# EAGLE design v1.1.0 (EAGLE 9.2.0)

## Sheet 1 of 2
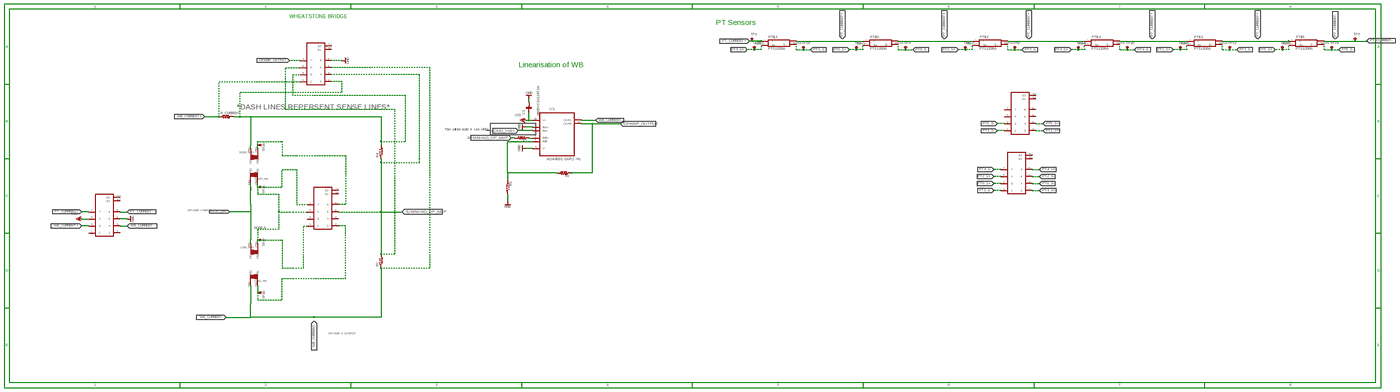
[diagram p0: schematic, sheet 1, overview]
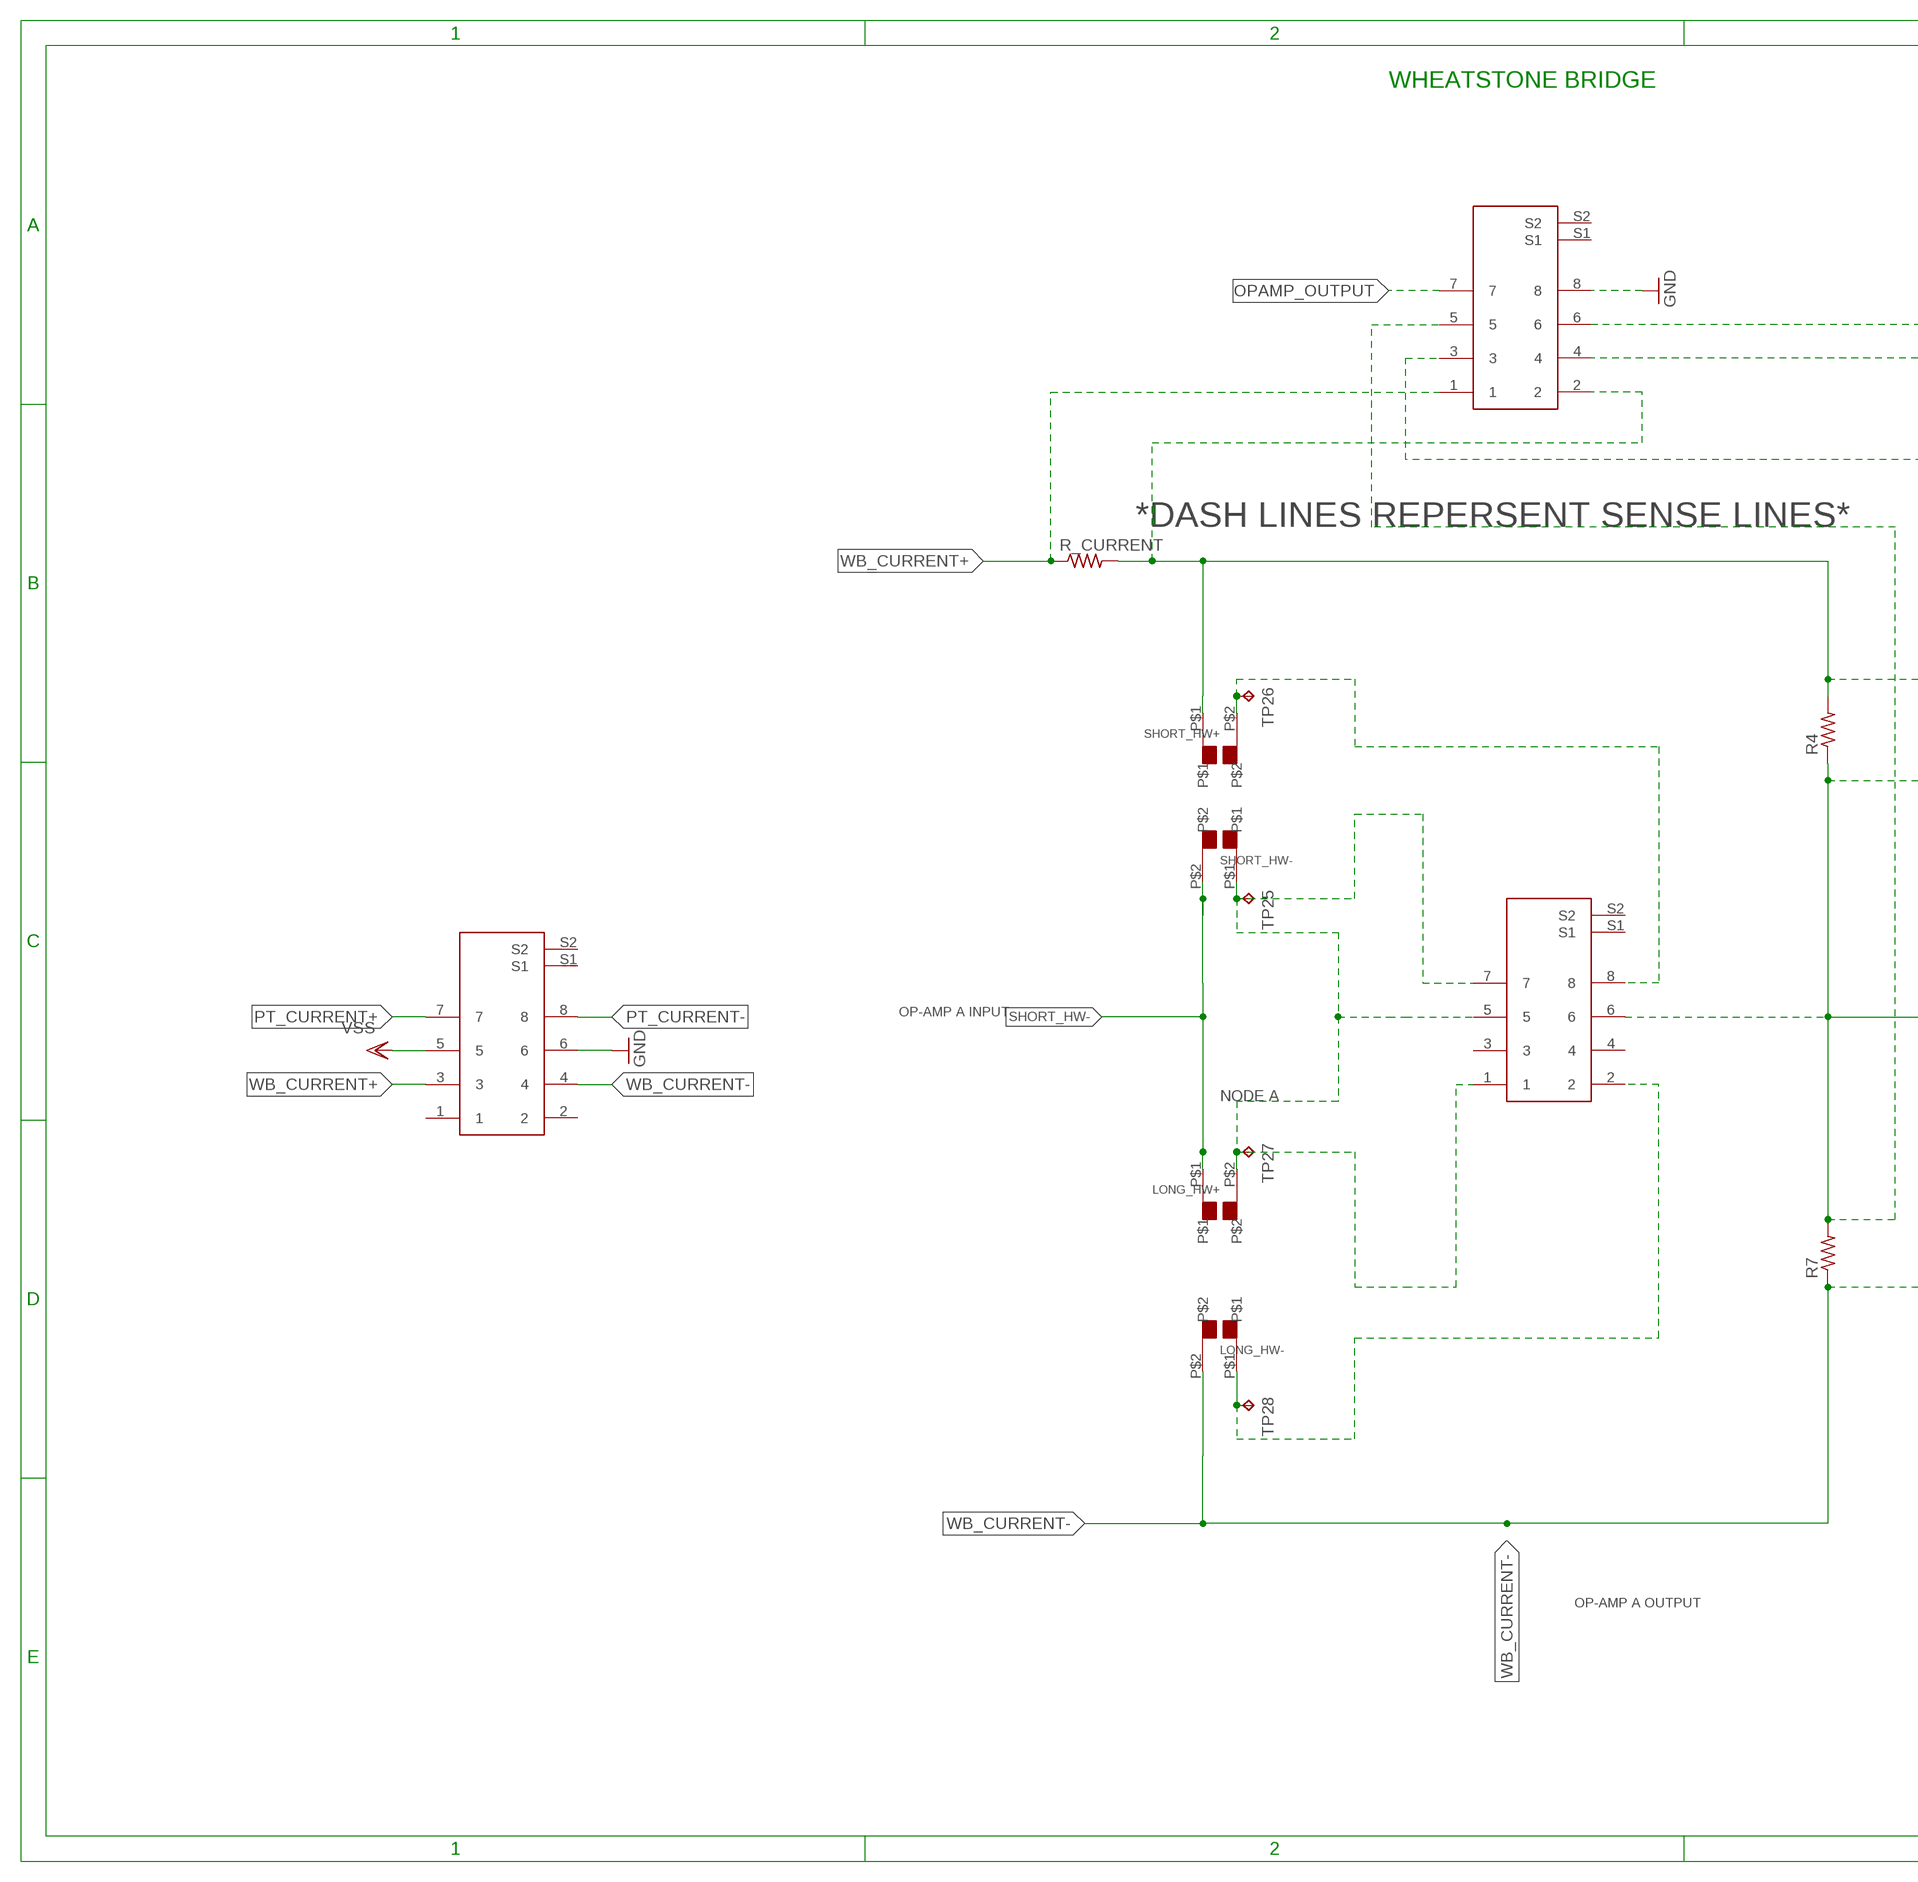
[diagram p1: schematic, sheet 1, part 1 of 4]
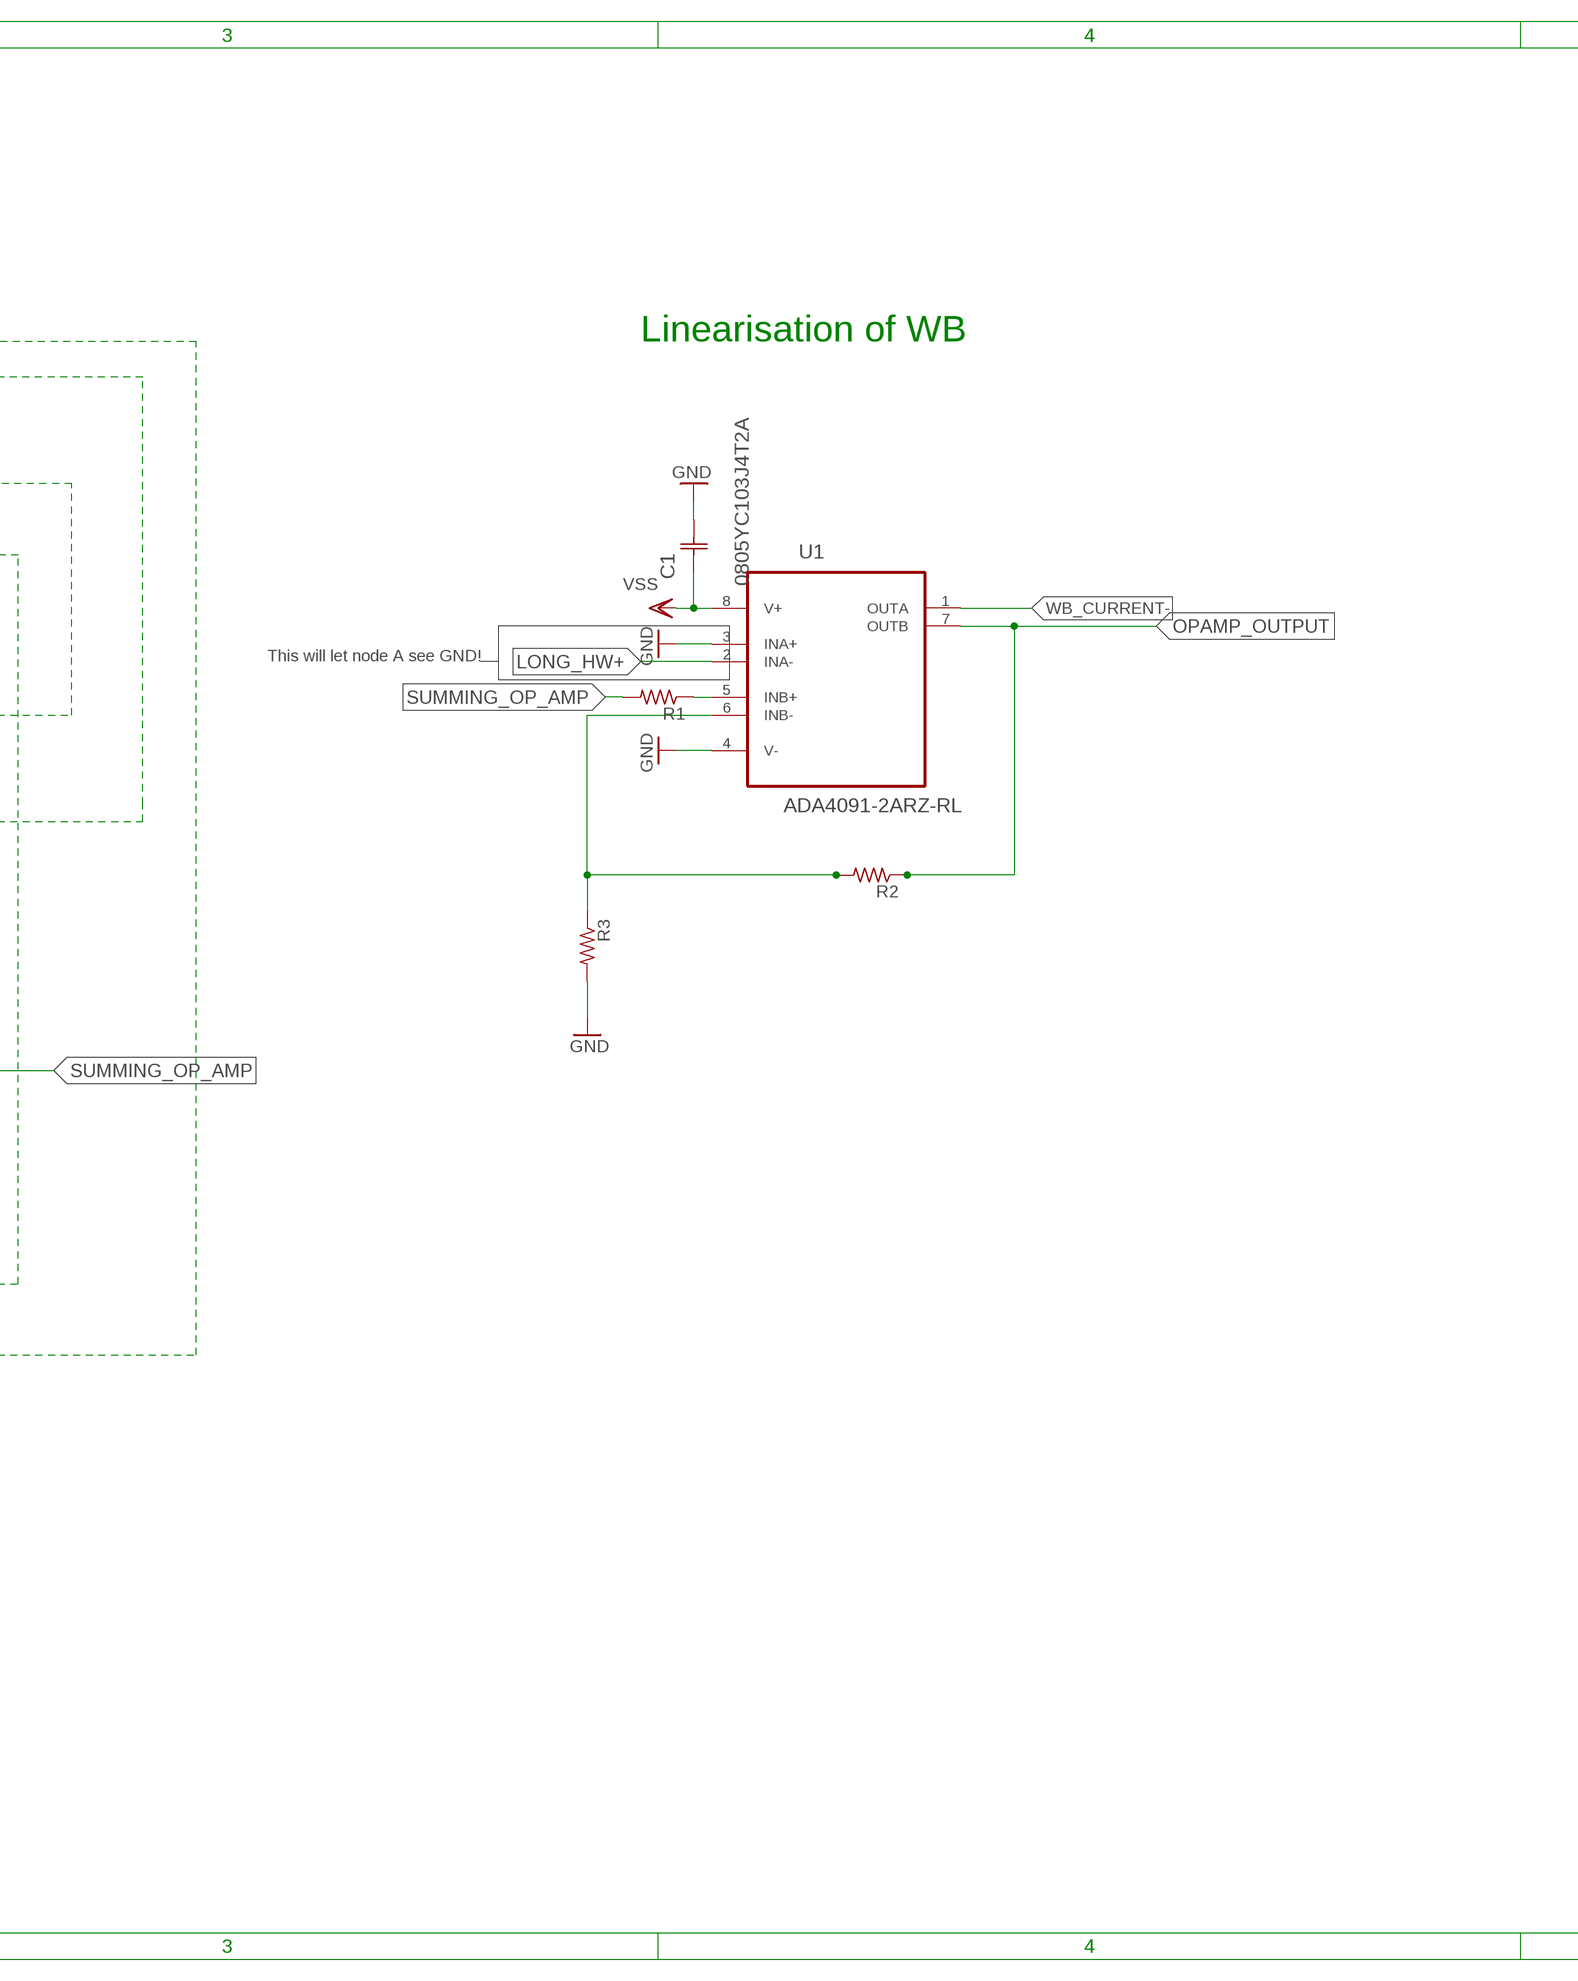
[diagram p2: schematic, sheet 1, part 2 of 4]
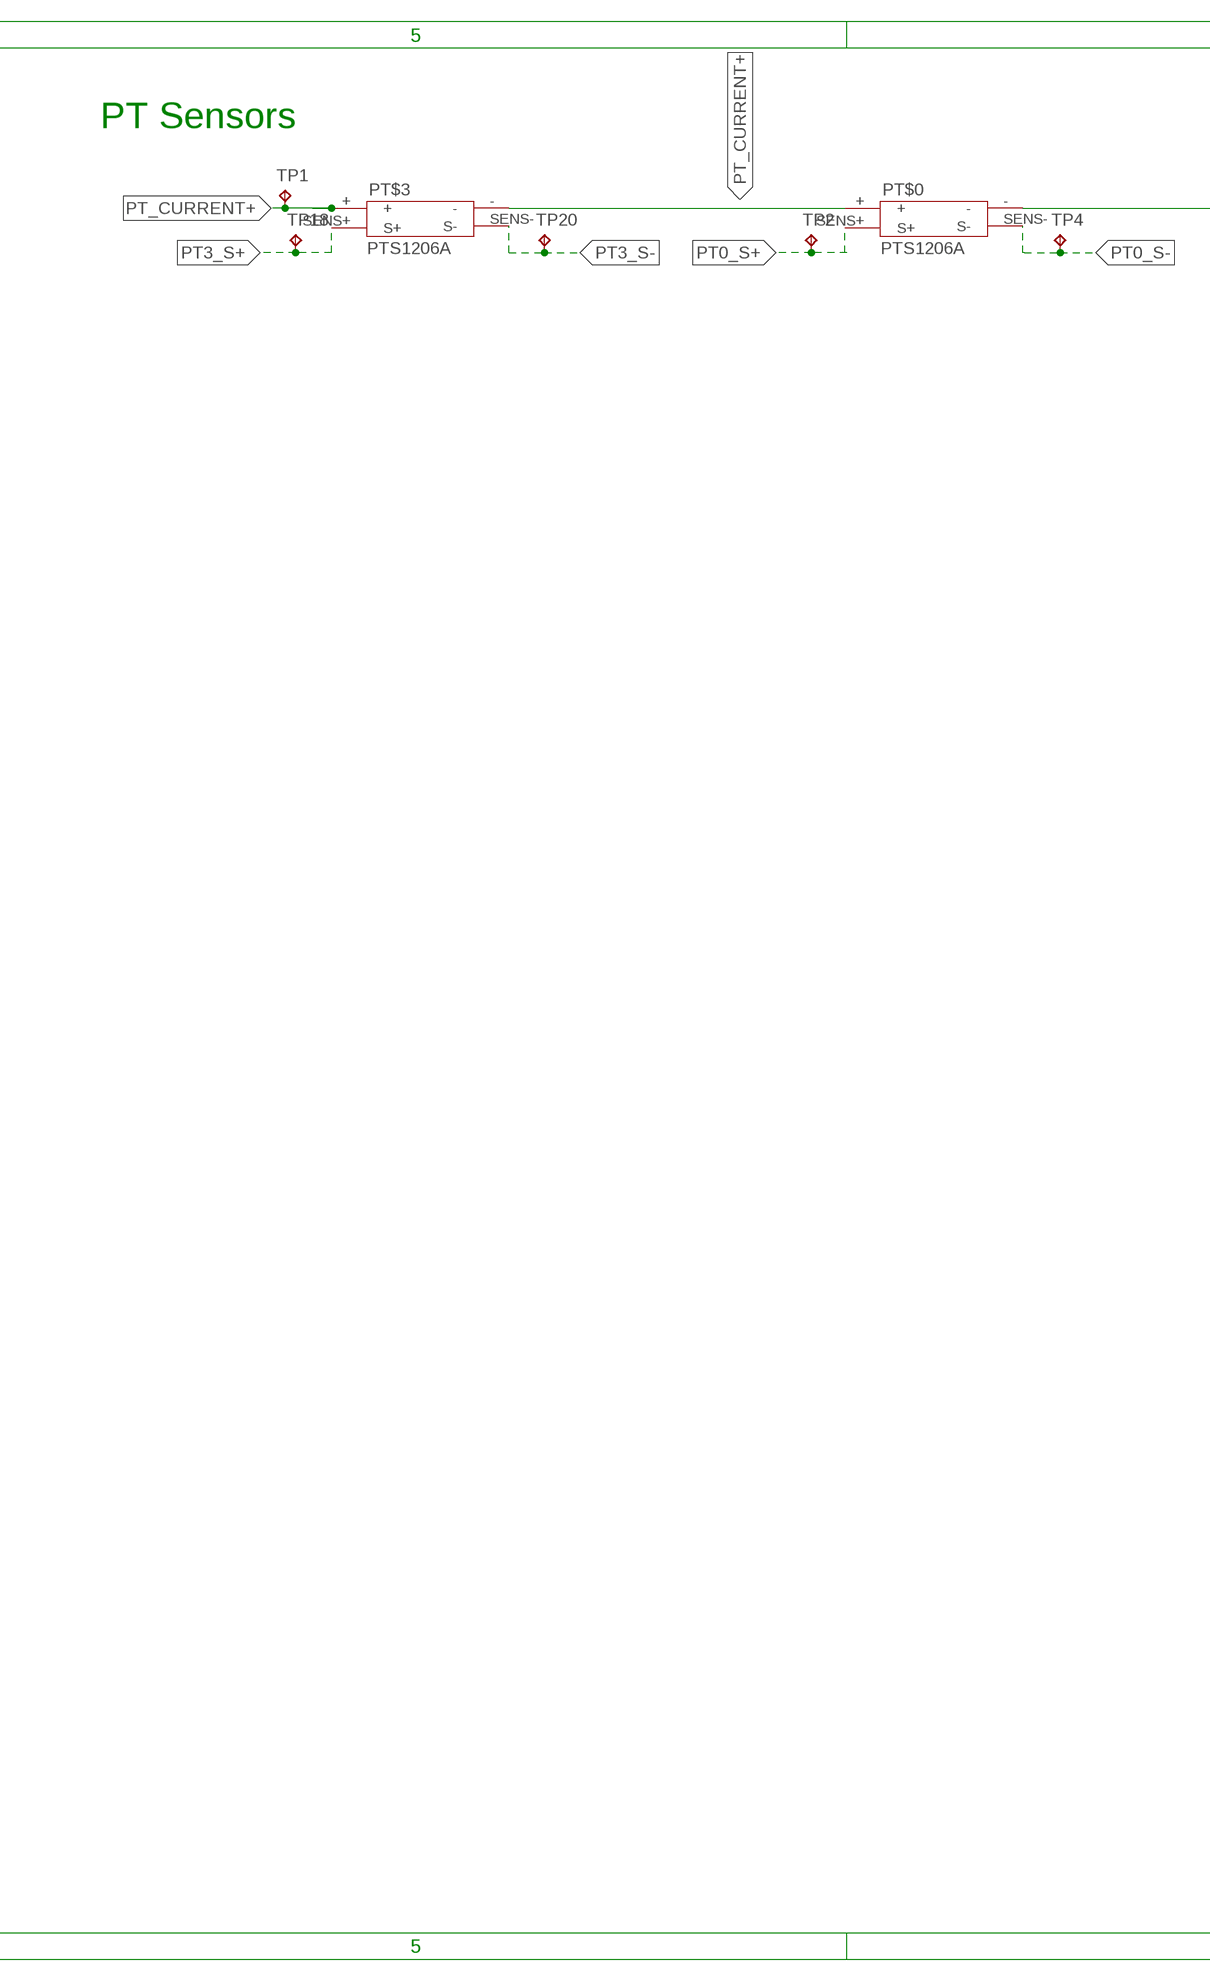
[diagram p3: schematic, sheet 1, part 3 of 4]
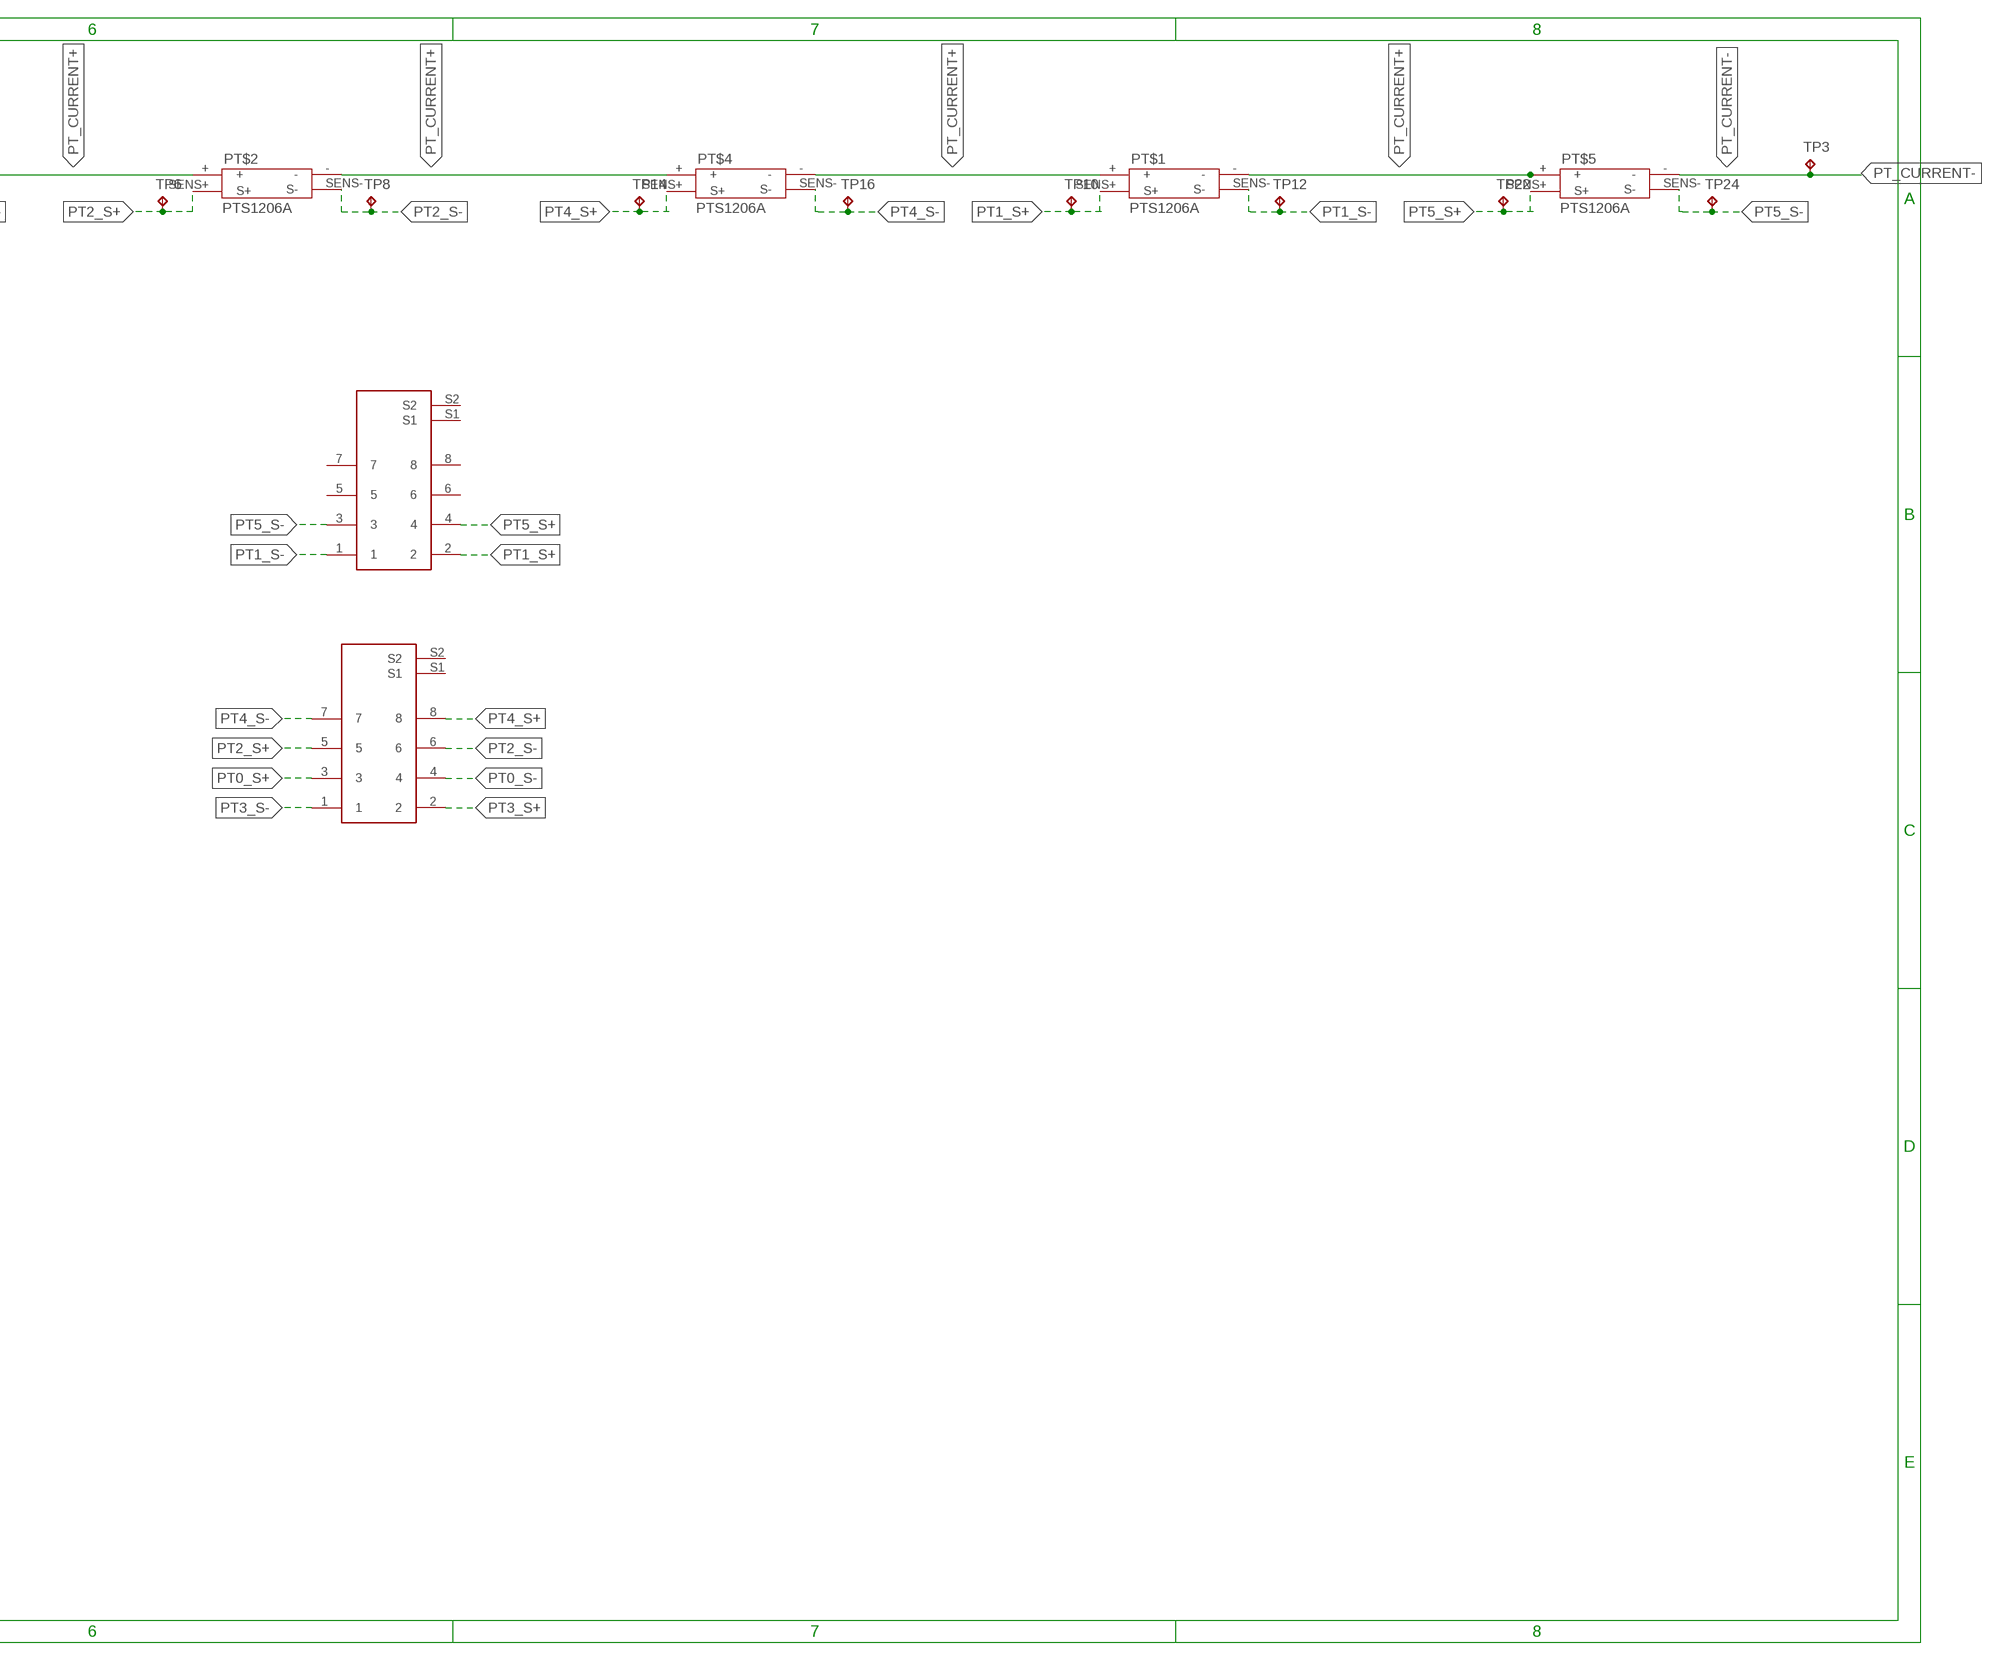
[diagram p4: schematic, sheet 1, part 4 of 4]

### Parts
C1  0805YC103J4T2A  [CAPC2012X94N]
LONG_HW+  WIREPOINT_1A  [WIREPOINT]
LONG_HW-  WIREPOINT_1A  [WIREPOINT]
POWER  RJ45_CONNECTOR  [RJ45_CONNNECTOR]
PT$0  PTS1206A  [CAPMP3216X166]
PT$1  PTS1206A  [CAPMP3216X166]
PT$2  PTS1206A  [CAPMP3216X166]
PT$3  PTS1206A  [CAPMP3216X166]
PT$4  PTS1206A  [CAPMP3216X166]
PT$5  PTS1206A  [CAPMP3216X166]
PT_SENS1  RJ45_CONNECTOR  [RJ45_CONNNECTOR]
PT_SENS2  RJ45_CONNECTOR  [RJ45_CONNNECTOR]
R1  R-US_M0805  [M0805]
R2  R-US_M0805  [M0805]
R3  R-US_M0805  [M0805]
R4  R-US_M0805  [M0805]
R7  R-US_M0805  [M0805]
R_CURRENT  R-US_M0805  [M0805]
SHORT_HW+  WIREPOINT_1A  [WIREPOINT]
SHORT_HW-  WIREPOINT_1A  [WIREPOINT]
TP1  TPTP10SQ  [TP10SQ]
TP2  TPTP10SQ  [TP10SQ]
TP3  TPTP10SQ  [TP10SQ]
TP4  TPTP10SQ  [TP10SQ]
TP6  TPTP10SQ  [TP10SQ]
TP8  TPTP10SQ  [TP10SQ]
TP10  TPTP10SQ  [TP10SQ]
TP12  TPTP10SQ  [TP10SQ]
TP14  TPTP10SQ  [TP10SQ]
TP16  TPTP10SQ  [TP10SQ]
TP18  TPTP10SQ  [TP10SQ]
TP20  TPTP10SQ  [TP10SQ]
TP22  TPTP10SQ  [TP10SQ]
TP24  TPTP10SQ  [TP10SQ]
TP25  TPTP10SQ  [TP10SQ]
TP26  TPTP10SQ  [TP10SQ]
TP27  TPTP10SQ  [TP10SQ]
TP28  TPTP10SQ  [TP10SQ]
U1  ADA4091-2ARZ-RL  [SOIC127P600X175-8N]
WB_SENS1  RJ45_CONNECTOR  [RJ45_CONNNECTOR]
WB_SENS2  RJ45_CONNECTOR  [RJ45_CONNNECTOR]

### Nets
GND: C1.2(C2) POWER.6 R3.2 U1.3(INA+) U1.4(V-) WB_SENS2.8
LONG_HW+: U1.2(INA-)
LONG_HW_SENS-: LONG_HW-.P$1 TP28.TP WB_SENS1.2
N$2: R1.1 U1.5(INB+)
N$4: R2.2 R3.1 U1.6(INB-)
OPAMP_OUTPUT: R2.1 U1.7(OUTB) WB_SENS2.7
PT0_S+: PT$0.SENS+(S+) PT_SENS2.3 TP2.TP
PT0_S-: PT$0.SENS-(S-) PT_SENS2.4 TP4.TP
PT1_S+: PT$1.SENS+(S+) PT_SENS1.2 TP10.TP
PT1_S-: PT$1.SENS-(S-) PT_SENS1.1 TP12.TP
PT2_S+: PT$2.SENS+(S+) PT_SENS2.5 TP6.TP
PT2_S-: PT$2.SENS-(S-) PT_SENS2.6 TP8.TP
PT3_S+: PT$3.SENS+(S+) PT_SENS2.2 TP18.TP
PT3_S-: PT$3.SENS-(S-) PT_SENS2.1 TP20.TP
PT4_S+: PT$4.SENS+(S+) PT_SENS2.8 TP14.TP
PT4_S-: PT$4.SENS-(S-) PT_SENS2.7 TP16.TP
PT5_S+: PT$5.SENS+(S+) PT_SENS1.4 TP22.TP
PT5_S-: PT$5.SENS-(S-) PT_SENS1.3 TP24.TP
PT_CURRENT+: POWER.7 PT$0.+ PT$0.- PT$1.+ PT$1.- PT$2.+ PT$2.- PT$3.+ PT$3.- PT$4.+ PT$4.- PT$5.+ TP1.TP
PT_CURRENT-: POWER.8 PT$5.- TP3.TP
SHORT_HW+: R4.2 R_CURRENT.2 SHORT_HW+.P$1 WB_SENS2.2 WB_SENS2.3
SHORT_HW-: LONG_HW+.P$1 SHORT_HW-.P$2
SHORT_HW_SENS+: SHORT_HW+.P$2 TP26.TP WB_SENS1.8
SHORT_HW_SENS-: LONG_HW+.P$2 SHORT_HW-.P$1 TP25.TP TP27.TP WB_SENS1.1 WB_SENS1.5 WB_SENS1.7
SUMMING_OP_AMP: R1.2 R4.1 R7.2 WB_SENS1.6 WB_SENS2.4 WB_SENS2.5
VSS: C1.1(C1) POWER.5 U1.8(V+)
WB_CURRENT+: POWER.3 R_CURRENT.1 WB_SENS2.1
WB_CURRENT-: LONG_HW-.P$2 POWER.4 R7.1 U1.1(OUTA) WB_SENS2.6
Unconnected: POWER.1 POWER.2 POWER.S1 POWER.S2 PT_SENS1.5 PT_SENS1.6 PT_SENS1.7 PT_SENS1.8 PT_SENS1.S1 PT_SENS1.S2 PT_SENS2.S1 PT_SENS2.S2 WB_SENS1.3 WB_SENS1.4 WB_SENS1.S1 WB_SENS1.S2 WB_SENS2.S1 WB_SENS2.S2

### Notes on the sheet
- WHEATSTONE BRIDGE
- PT Sensors
- Linearisation of WB
- *DASH LINES REPERSENT SENSE LINES*
- This will let node A see GND!
- OP-AMP A INPUT
- NODE A
- OP-AMP A OUTPUT

## Sheet 2 of 2

## Library data of the parts
C1 = 0805YC103J4T2A:0805YC103J4T2A: Capacitor 0805; AVAILABILITY: Unavailable; DESCRIPTION: Cap Ceramic 0.01uF 16V X7R 5% SMD 0805 125°C Paper T/R; MF: AVX; MP: 0805YC103J4T2A; PACKAGE: 0805 AVX; PRICE: None
LONG_HW+ LONG_HW- SHORT_HW+ SHORT_HW- = WIREPOINT:WIREPOINT_1
POWER PT_SENS1 PT_SENS2 WB_SENS1 WB_SENS2 = RJ45_CONNECTOR:RJ45_CONNECTOR
PT$0 PT$1-PT$5 = PTS1206:PTS1206
R1-R4 R7 R_CURRENT = resistor:R-US_: RESISTOR, American symbol
TP1-TP4 TP6 TP8 TP10 TP12 TP14 TP16 TP18 TP20 TP22 TP24-TP28 = testpad:TP: Test pad
U1 = ADA4091-2ARZ-RL:ADA4091-2ARZ-RL: Precision Micropower Operational Amplifier; AVAILABILITY: Unavailable; DESCRIPTION: Ic Opamp Gp 1.27mhz Rro 8soic; MF: Analog; MP: ADA4091-2ARZ-RL; PACKAGE: SOIC-8 Analog Devices; PRICE: 3.30 USD

## Board
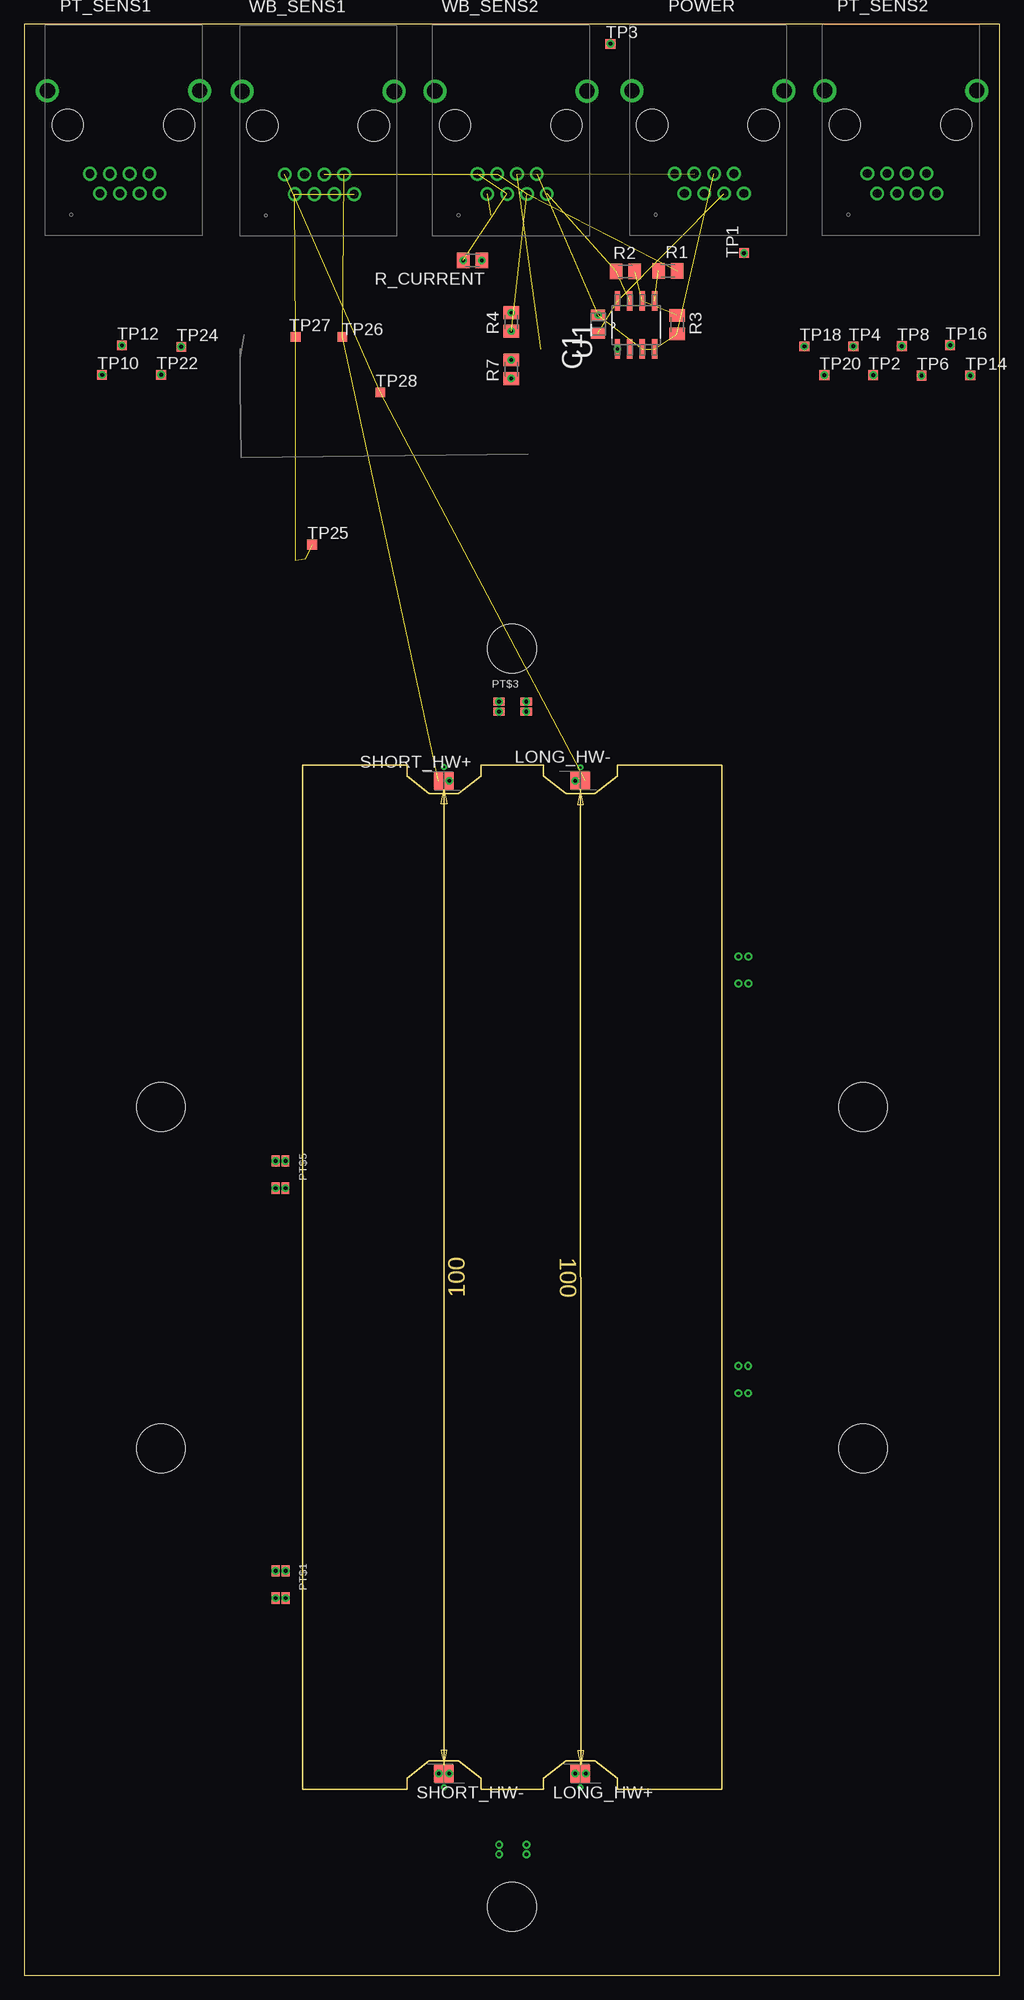
[diagram p5: board, top side]
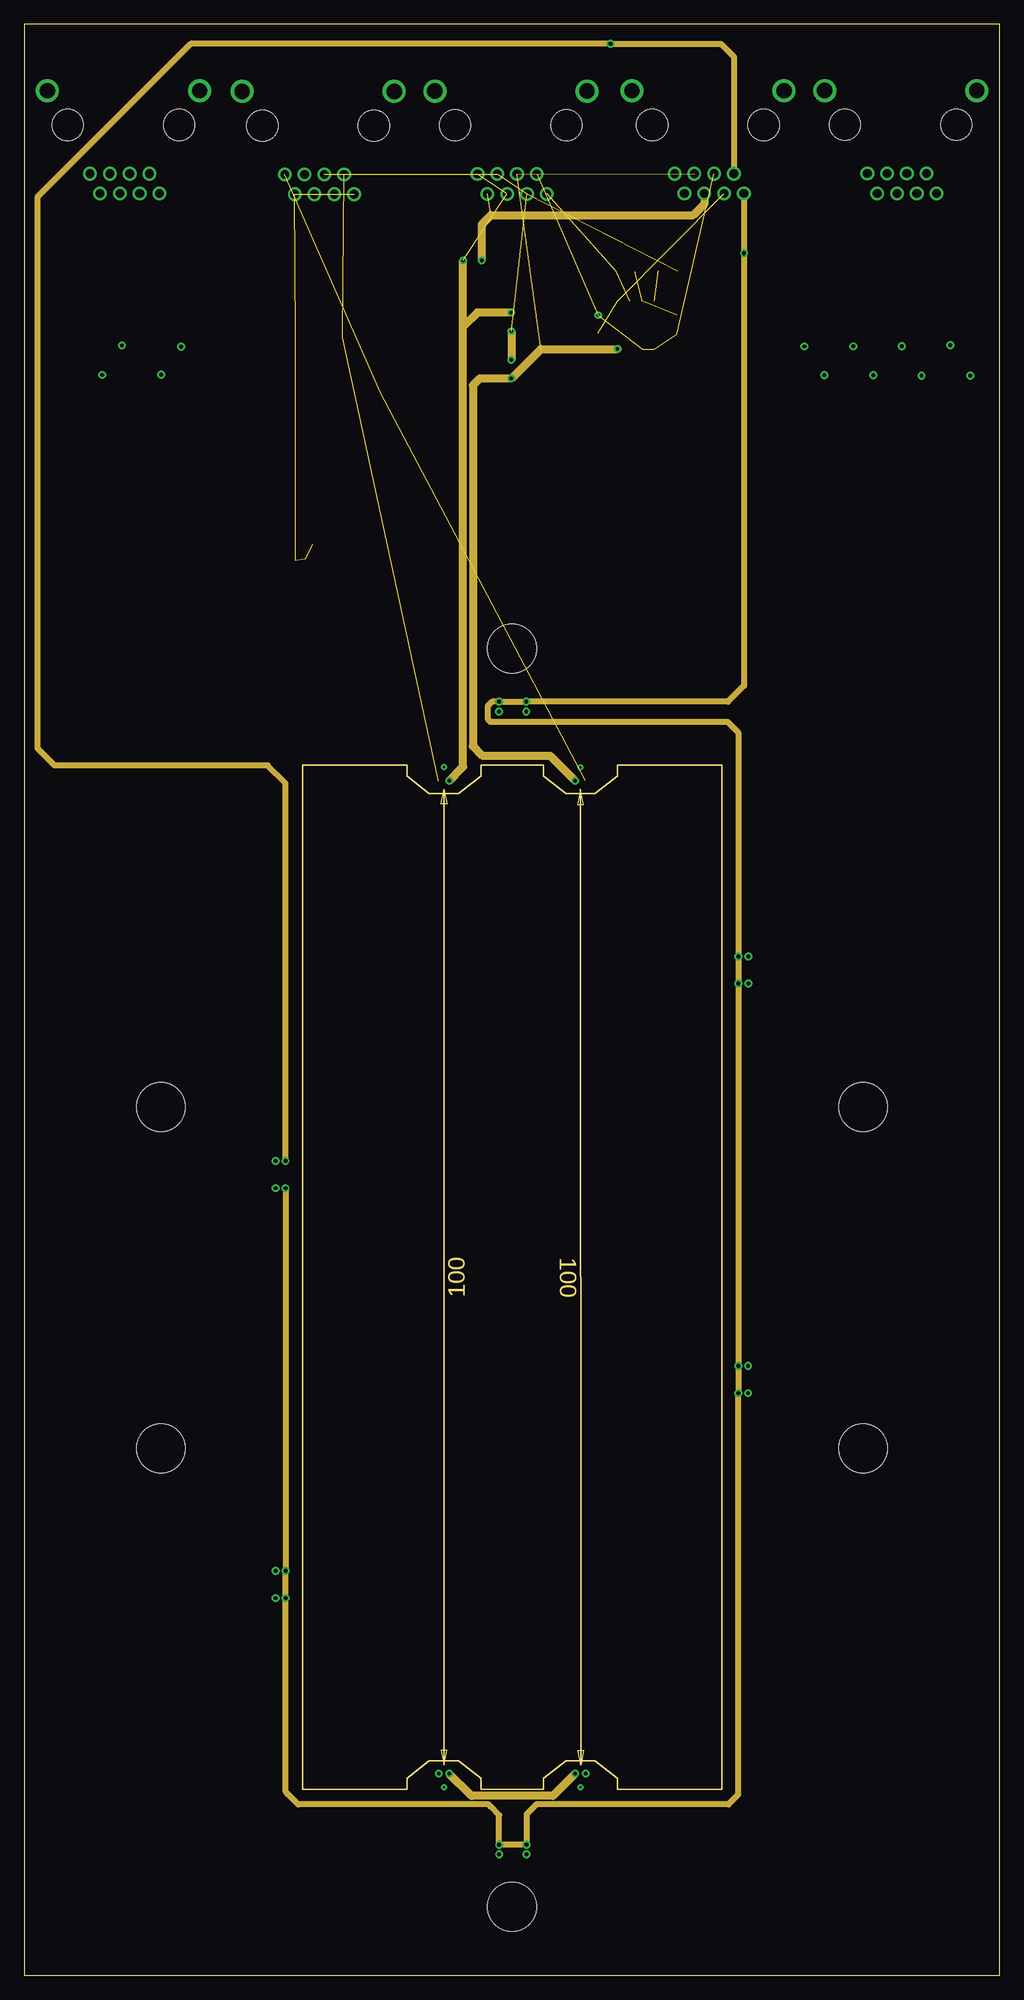
[diagram p6: board, inner layer Route2]
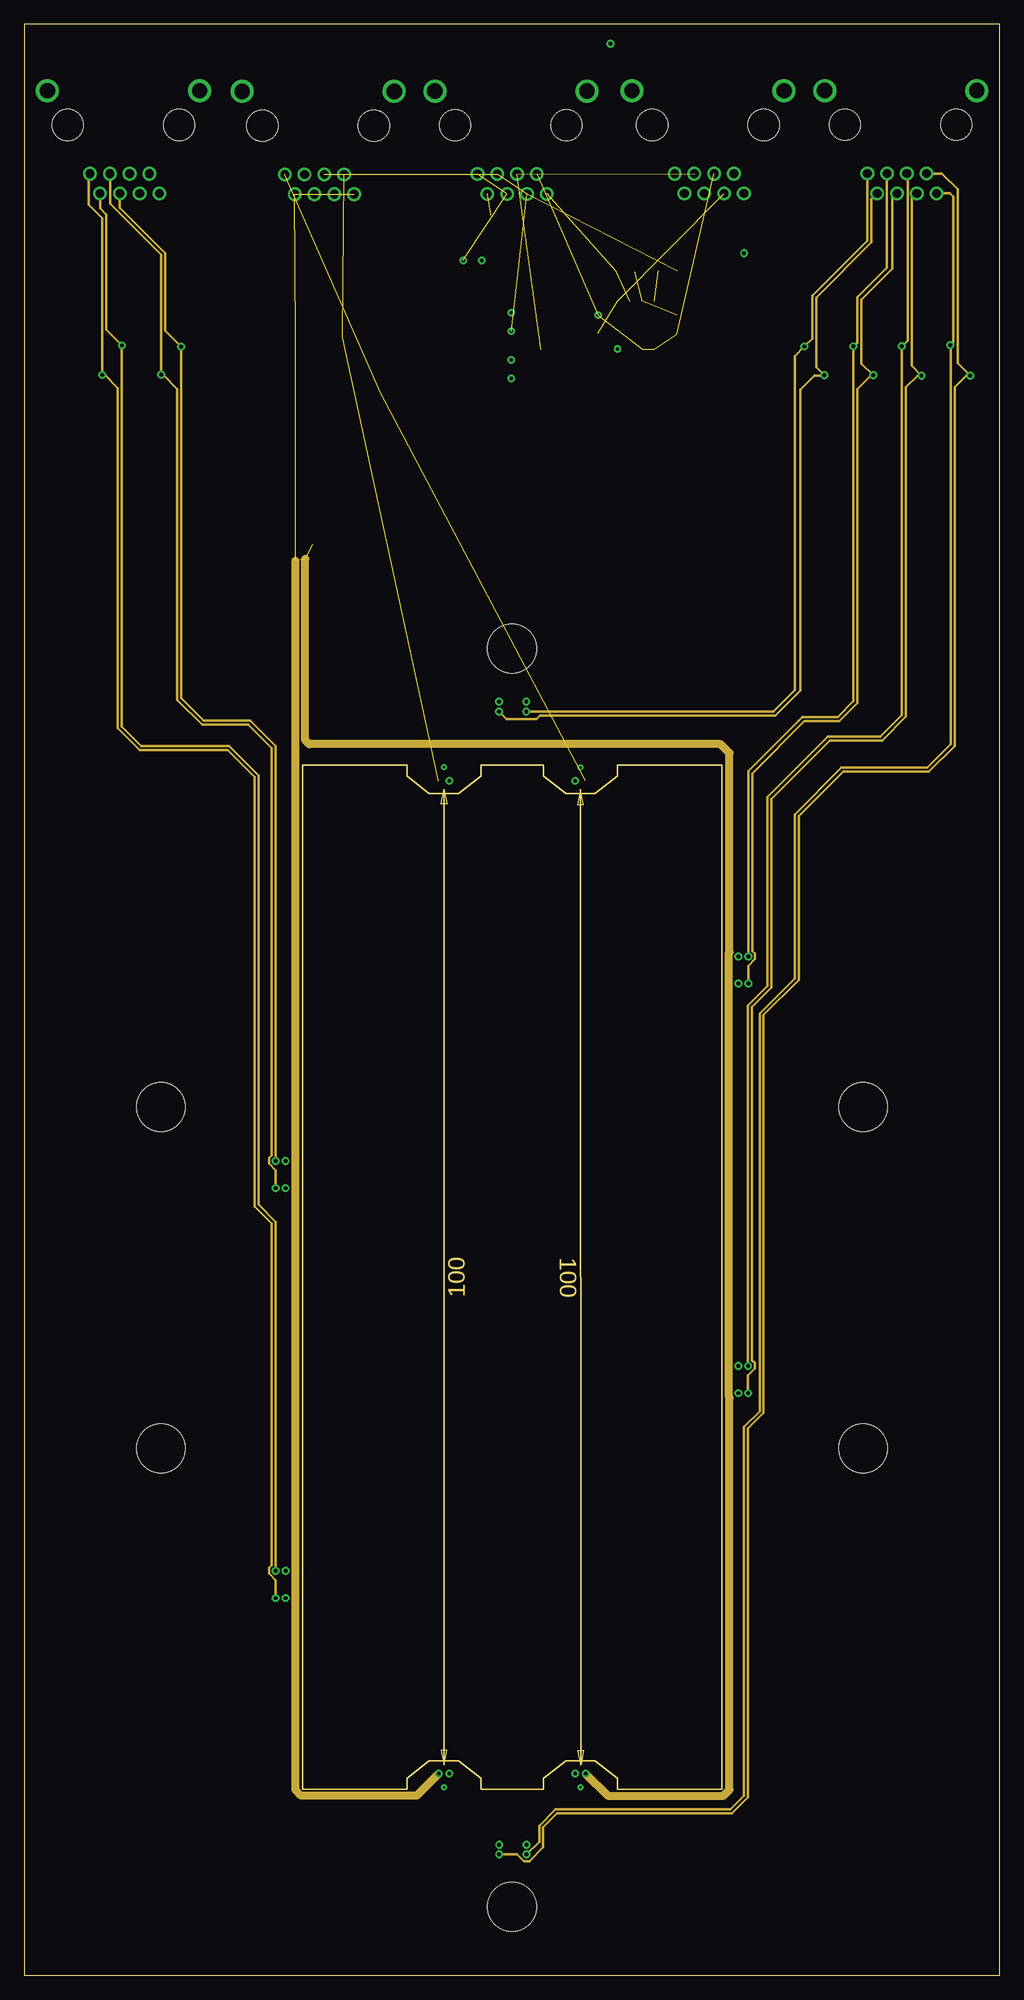
[diagram p7: board, inner layer Route3]
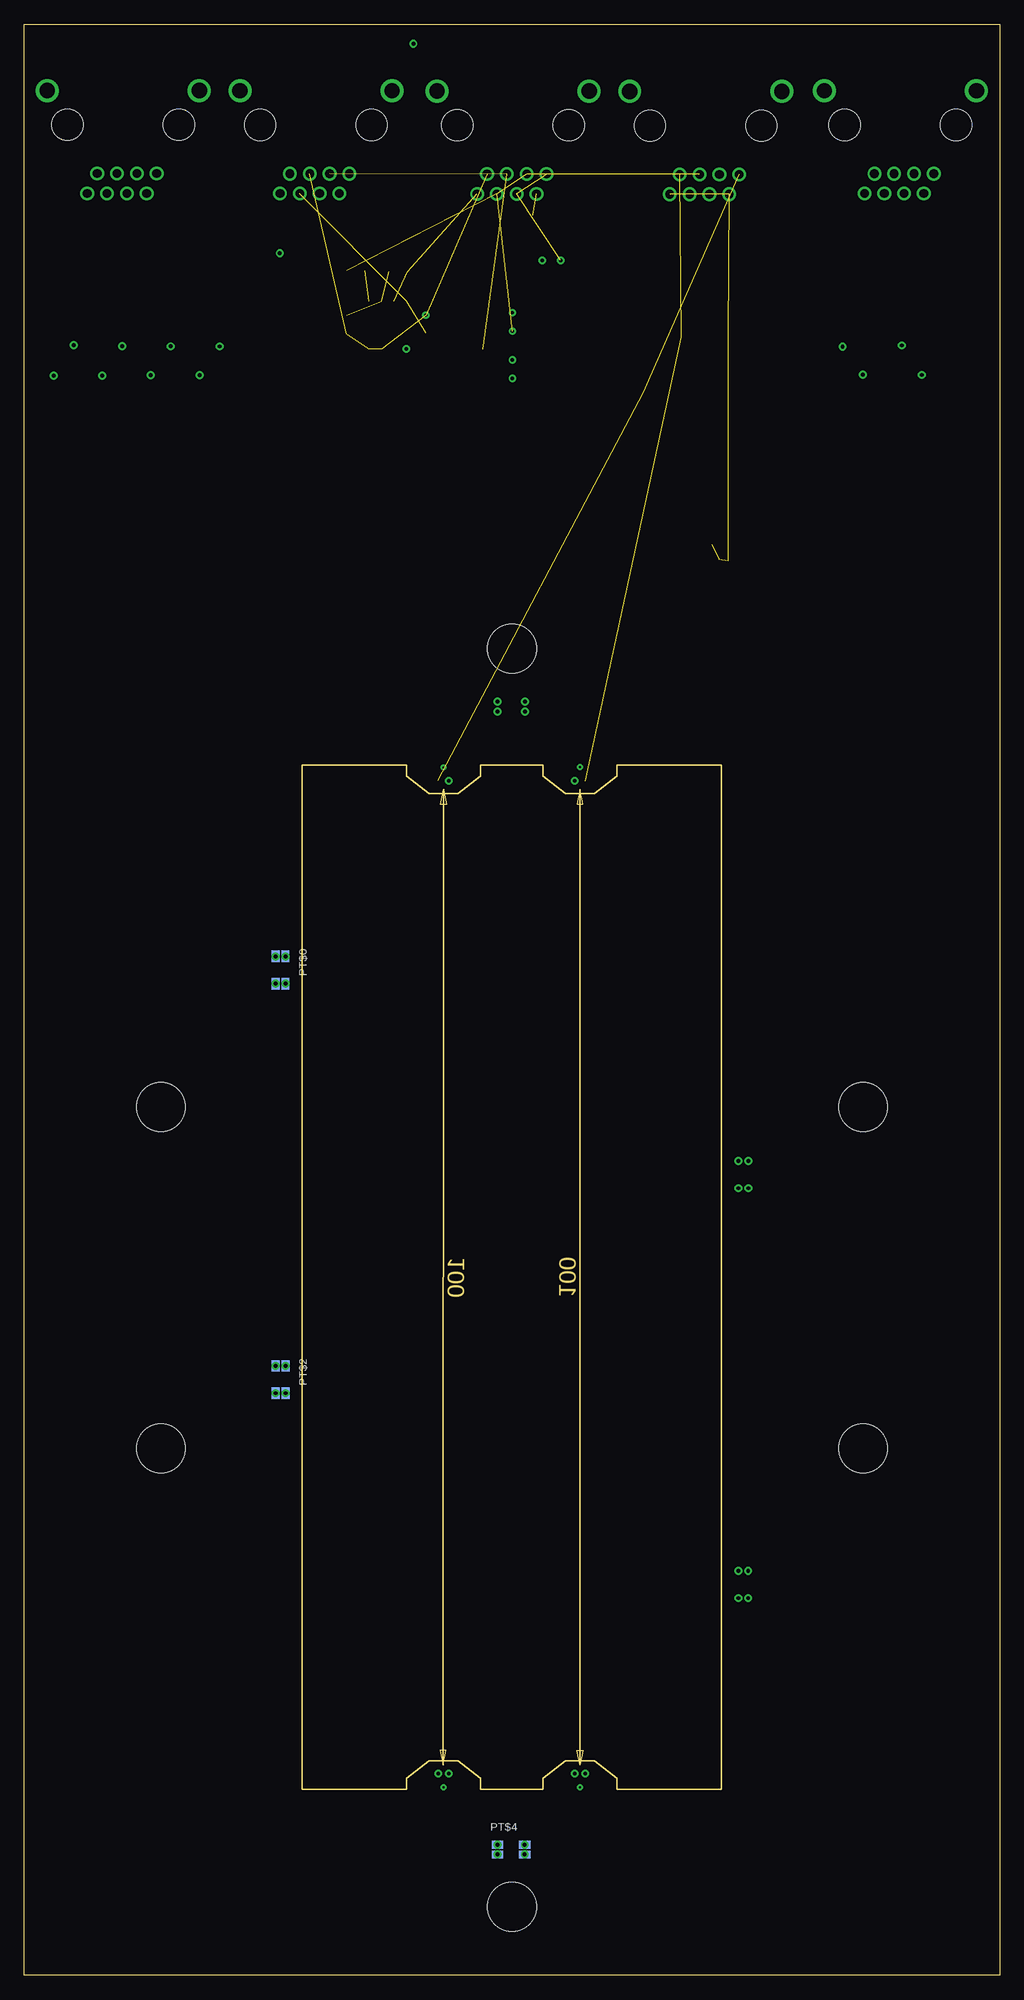
[diagram p8: board, bottom side, seen from below]

Size 100 x 200 mm. Coordinates in mm from the lower left corner, seen from the top.
Outline: 0,0 100,0 100,200 0,200 0,0
Copper layers (1*2*3*16): Top 0.035mm / dielectric 0.8675mm / Route2 0.035mm / dielectric 0.15mm / Route3 0.035mm / dielectric 0.2mm / Bottom 0.035mm
Design rules "default *": minimum track width 6mil, minimum drill 0.35mm, track to track 6mil, track to pad 6mil, pad to pad 6mil, via to via 6mil, smd to smd 6mil, copper to edge 40mil, drill to drill 6mil, minimum pad ring 10mil, minimum via ring 8mil, stop-mask expansion 4mil, vias tented up to drill 0mil, thermal gap 10mil
Holes 5 mm at 50,136 14,54 86,54 50,7 86,89 14,89
Milling: 28 lines

### Footprints (pad centres in the part's own frame; a part is rotated, then mirrored left to right if it is on the bottom)
CAPC2012X94N = smd 1.118 x 1.448: 1 -0.914,0; 2 0.914,0
WIREPOINT = smd 0.914 x 1.778: P$1 -0.537,-0.001; P$2 0.54,0
RJ45_CONNNECTOR = drill 0.89: 1 10.47,17.27; 2 11.49,15.24; 3 8.44,17.27; 4 9.46,15.24; 5 6.41,17.27; 6 7.43,15.24; 7 4.38,17.27; 8 5.4,15.24 | drill 1.57: S1 0.265,6.73; S2 15.865,6.73 | hole 3.2: 2.35,10.24; 13.78,10.24
CAPMP3216X166 = smd 1.15 x 0.8: + 1.4,0.5; - -1.4,0.5; SENS+ 1.4,-0.5; SENS- -1.4,-0.5
M0805 = smd 1.3 x 1.6: 1 -0.95,0; 2 0.95,0
TP10SQ = smd 1 x 1: TP 0,0
SOIC127P600X175-8N = smd 1.981 x 0.559: 1 -2.464,1.905; 2 -2.464,0.635; 3 -2.464,-0.635; 4 -2.464,-1.905; 5 2.464,-1.905; 6 2.464,-0.635; 7 2.464,0.635; 8 2.464,1.905

### Placement (x,y rotation side)
C1  58.84,169.27 90 top
LONG_HW+  57.02,20.66 0 top
LONG_HW-  57.02,122.46 180 top
POWER  78.16,199.94 180 top
PT$0  73.73,103.05 270 bottom
PT$1  26.27,40.05 270 top
PT$2  73.72,61.06 270 bottom
PT$3  50.06,130.06 0 top
PT$4  50.09,12.87 0 bottom
PT$5  26.27,82.07 270 top
PT_SENS1  18.23,199.93 180 top
PT_SENS2  97.93,199.95 180 top
R1  66,174.73 0 top
R2  61.65,174.65 0 top
R3  66.94,169.22 270 top
R4  49.95,169.5 90 top
R7  49.95,164.63 90 top
R_CURRENT  45.96,175.81 180 top
SHORT_HW+  43.02,122.44 180 top
SHORT_HW-  43.02,20.66 0 top
TP1  73.81,176.56 90 top
TP2  87.04,164.03 0 top
TP3  60.11,198 0 top
TP4  85.02,166.99 0 top
TP6  92,163.99 0 top
TP8  89.99,167 0 top
TP10  7.97,164.07 0 top
TP12  10,167.09 0 top
TP14  96.99,164 0 top
TP16  94.94,167.1 0 top
TP18  79.99,166.99 0 top
TP20  82.03,164.03 0 top
TP22  14.03,164.07 0 top
TP24  16.1,166.94 0 top
TP25  29.5,146.66 0 top
TP26  32.62,167.95 0 top
TP27  27.82,167.96 0 top
TP28  36.51,162.26 0 top
U1  62.73,169.18 90 top
WB_SENS1  38.19,199.86 180 top
WB_SENS2  57.95,199.89 180 top

### Tracks (layer width: path | path; a pad name or v marks a point on that pad's centre or on a via)
GND  (via drill 0.35)  (5 unrouted)
  other vias: 58.84,170.19
LONG_HW_SENS-  (2 unrouted)
N$1  (via drill 0.2)
  other vias: 43.02,123.85
N$2  (1 unrouted)
N$3  (via drill 0.2)
  other vias: 57.02,123.83
N$4  (2 unrouted)
N$5  (via drill 0.2)
  other vias: 57.02,19.27
N$6  (via drill 0.2)
  other vias: 43.02,19.27
OPAMP_OUTPUT  (2 unrouted)
PT0_S+  (via drill 0.4)
  Route3 0.254: PT$0.SENS+ 74.23,103.48 74.91,104.17 74.91,104.73 74.64,105.01 74.64,123.2 80,128.56 80,128.59 83.57,128.59 85.41,130.43 85.41,162.6 86.84,164.03 TP2.TP 85.84,165.23 85.84,171.77 89.01,174.93 89.01,182.2 PT_SENS2.3
  other vias: 74.23,101.65 87.04,164.03
PT0_S-  (via drill 0.4)
  Route3 0.254: PT$0.SENS- 74.23,123.43 79.4,128.6 79.8,129 83.4,129 85,130.6 85,166.97 | 85,166.97 TP4.TP | TP4.TP 85,166.97 | PT_SENS2.4 88.44,184.68 88.44,175.04 85.42,172.01 85.42,167.39 TP4.TP
  other vias: 74.23,104.45 85.02,166.99
PT1_S+  (via drill 0.4)
  Route3 0.254: PT$1.SENS+ 25.77,40.49 25.09,41.17 25.09,41.74 25.37,42.01 25.37,77.06 23.59,78.83 23.59,122.83 20.83,125.59 11.83,125.59 9.59,127.83 9.59,162.7 8.23,164.07 TP10.TP 7.97,180.15 6.58,181.54 6.58,184.53 PT_SENS1.2
  other vias: 25.77,38.66 7.97,164.07
PT1_S-  (via drill 0.4)
  Route3 0.254: PT$1.SENS- 25.77,77.22 24,79 24,123 21,126 12,126 10,128 TP12.TP 8.4,168.69 8.4,180.49 7.76,181.13 PT_SENS1.1
  other vias: 25.77,41.45 10,167.09
PT2_S+  (via drill 0.4)
  Route3 0.254: PT$2.SENS+ 74.22,61.5 74.9,62.18 74.9,62.74 74.63,63.02 74.63,99.25 76.61,101.23 76.61,120.6 82.6,126.59 87.97,126.59 90.41,129.03 90.41,162.8 91.59,163.99 TP6.TP 91,164.99 91,182.16 PT_SENS2.5
  other vias: 74.22,59.66 92,163.99
PT2_S-  (via drill 0.4)
  Route3 0.254: PT$2.SENS- 74.22,99.42 76.2,101.4 76.2,120.8 82.4,127 87.8,127 90,129.2 90,166.98 | 90,166.98 TP8.TP | TP8.TP 90,166.98 | TP8.TP 90.58,167.59 90.58,184.63 PT_SENS2.6
  other vias: 74.22,62.46 89.99,167
PT3_S+  (via drill 0.4)
  Route3 0.254: v51.47,129.56 76.79,129.56 79,131.77 79,164 79,166 TP18.TP 80.79,167.79 80.79,172.17 86.44,177.81 PT_SENS2.2
  other vias: 79.99,166.99
PT3_S-  (via drill 0.4)
  Route3 0.254: PT$3.SENS- 49.42,128.8 52.52,128.8 52.86,129.14 76.99,129.14 79.56,131.72 79.56,162.56 81,164 82,164 | 82,164 TP20.TP | TP20.TP 82,164 | TP20.TP 81.2,164.85 81.2,172 86.86,177.66 86.86,182.08 PT_SENS2.1
  other vias: 48.66,129.56 82.03,164.03
PT4_S+  (via drill 0.4)
  Route3 0.254: PT$4.SENS+ 50.53,12.37 51.21,11.69 51.78,11.69 53.21,13.12 53.21,15.17 54.63,16.59 72.57,16.59 74.21,18.23 74.21,56.03 75.81,57.63 75.81,98.43 79.41,102.03 79.41,118.83 83.97,123.39 92.77,123.39 95.41,126.03 95.41,162.8 96.61,164 TP14.TP 95.72,165.27 95.72,183.08 94.09,184.71 PT_SENS2.8
  other vias: 48.69,12.37 96.99,164
PT4_S-  (via drill 0.4)
  Route3 0.254: PT$4.SENS- 52.8,13.68 52.8,15.34 54.47,17 72.4,17 73.8,18.4 73.8,56.2 75.4,57.8 75.4,98.6 79,102.2 79,119 83.8,123.8 92.6,123.8 95,126.2 95,167.04 TP16.TP 95.26,167.43 95.26,182.34 94.92,182.68 PT_SENS2.7
  other vias: 51.49,12.37 94.94,167.1
PT5_S+  (via drill 0.4)
  Route3 0.254: PT$5.SENS+ 25.77,82.51 25.09,83.19 25.09,83.76 25.36,84.03 25.36,125.8 22.97,128.19 18.23,128.19 15.69,130.74 15.69,162.6 14.22,164.07 TP22.TP 14.03,176.37 8.8,181.6 8.8,184.66 PT_SENS1.4
  other vias: 25.77,80.67 14.03,164.07
PT5_S-  (via drill 0.4)
  Route3 0.254: PT$5.SENS- 25.77,126 23.16,128.6 18.4,128.6 16.1,130.9 TP24.TP 14.44,168.6 14.44,176.54 9.79,181.19 PT_SENS1.3
  other vias: 25.77,83.47 16.1,166.94
PT_CURRENT+  (via drill 0.4)
  Route2 0.61: POWER.7 73.78,176.58 TP1.TP 73.81,132.21 72.16,130.56 v51.47,130.56 | v51.47,130.56 | v51.47,130.56 PT$3.- 47.96,130.56 47.5,130.1 47.5,128.8 47.8,128.5 72.1,128.5 73.2,127.4 73.2,104.48 PT$0.- PT$0.+ PT$2.- PT$2.+ 73.22,18.52 72.2,17.5 52.5,17.5 51.49,16.49 PT$4.- PT$4.+ 48.69,16.41 47.8,17.3 47.6,17.5 28.08,17.5 26.99,18.59 | v51.47,130.56 | 26.99,18.59 | 26.99,18.59 26.8,18.78 26.8,38.63 PT$1.+ PT$1.- PT$5.+
  other vias: 73.81,176.56 73.22,62.46 48.69,13.37 51.49,13.37 48.66,130.56 73.23,104.45 73.23,101.65 73.22,59.66 26.77,41.45 26.77,38.66 26.77,80.67
PT_CURRENT-  (via drill 0.4)
  Route2 0.61: PT$5.- 26.77,122.21 24.96,124.02 3.1,124.02 1.32,125.8 1.32,182.26 17.06,198 TP3.TP 71.44,198 72.77,196.67 72.77,184.7 POWER.8
  other vias: 26.77,83.47 60.11,198
SHORT_HW+  (via drill 0.35)  (2 unrouted)
  Route2 0.813: SHORT_HW+.P$1 45,123.88 45,169 | R4.2 46.45,170.44 45,169 | R_CURRENT.2 45,169
  other vias: 43.56,122.44 49.95,170.44 45.01,175.81
SHORT_HW-  (via drill 0.35)
  Route2 0.813: SHORT_HW-.P$2 45.86,18.36 54.19,18.36 LONG_HW+.P$1
  other vias: 43.56,20.66 56.48,20.66
SHORT_HW_SENS+  (2 unrouted)
SHORT_HW_SENS-  (via drill 0.35)  (6 unrouted)
  Route3 0.813: SHORT_HW-.P$1 40.22,18.4 28.4,18.4 27.8,19 27.8,145 | LONG_HW+.P$2 59.82,18.4 71.7,18.4 72.3,19 72.3,59.22 72.26,59.26 72.26,104.84 72.3,104.88 72.3,125.3 71.4,126.2 29.2,126.2 28.8,126.6 28.8,145.2
  other vias: 42.48,20.66 57.56,20.66
SUMMING_OP_AMP  (via drill 0.35)  (4 unrouted)
  Route2 0.813: v49.95,168.54 v49.95,165.59
VSS  (2 unrouted)
WB_CURRENT+  (via drill 0.35)  (1 unrouted)
  Route2 0.813: POWER.3 69.72,181.57 68.6,180.45 47.85,180.45 46.91,179.51 R_CURRENT.1
  other vias: 46.91,175.81
WB_CURRENT-  (via drill 0.35)  (2 unrouted)
  Route2 0.813: LONG_HW-.P$2 53.94,125 47,125 46,126 46,163 46.69,163.69 R7.1 52.98,166.71 U1.1
  other vias: 56.48,122.46 60.82,166.71 49.95,163.69

### Text on the board
bDocu: Wheatstone bridge